# Altium schematic sheet GPS_LoraWAN.SchDoc: GPS and LoraWAN
size A4; DrawnBy: Carles Bataller Sebastiá; Revision: A; SheetNumber: 2; SheetTotal: 3
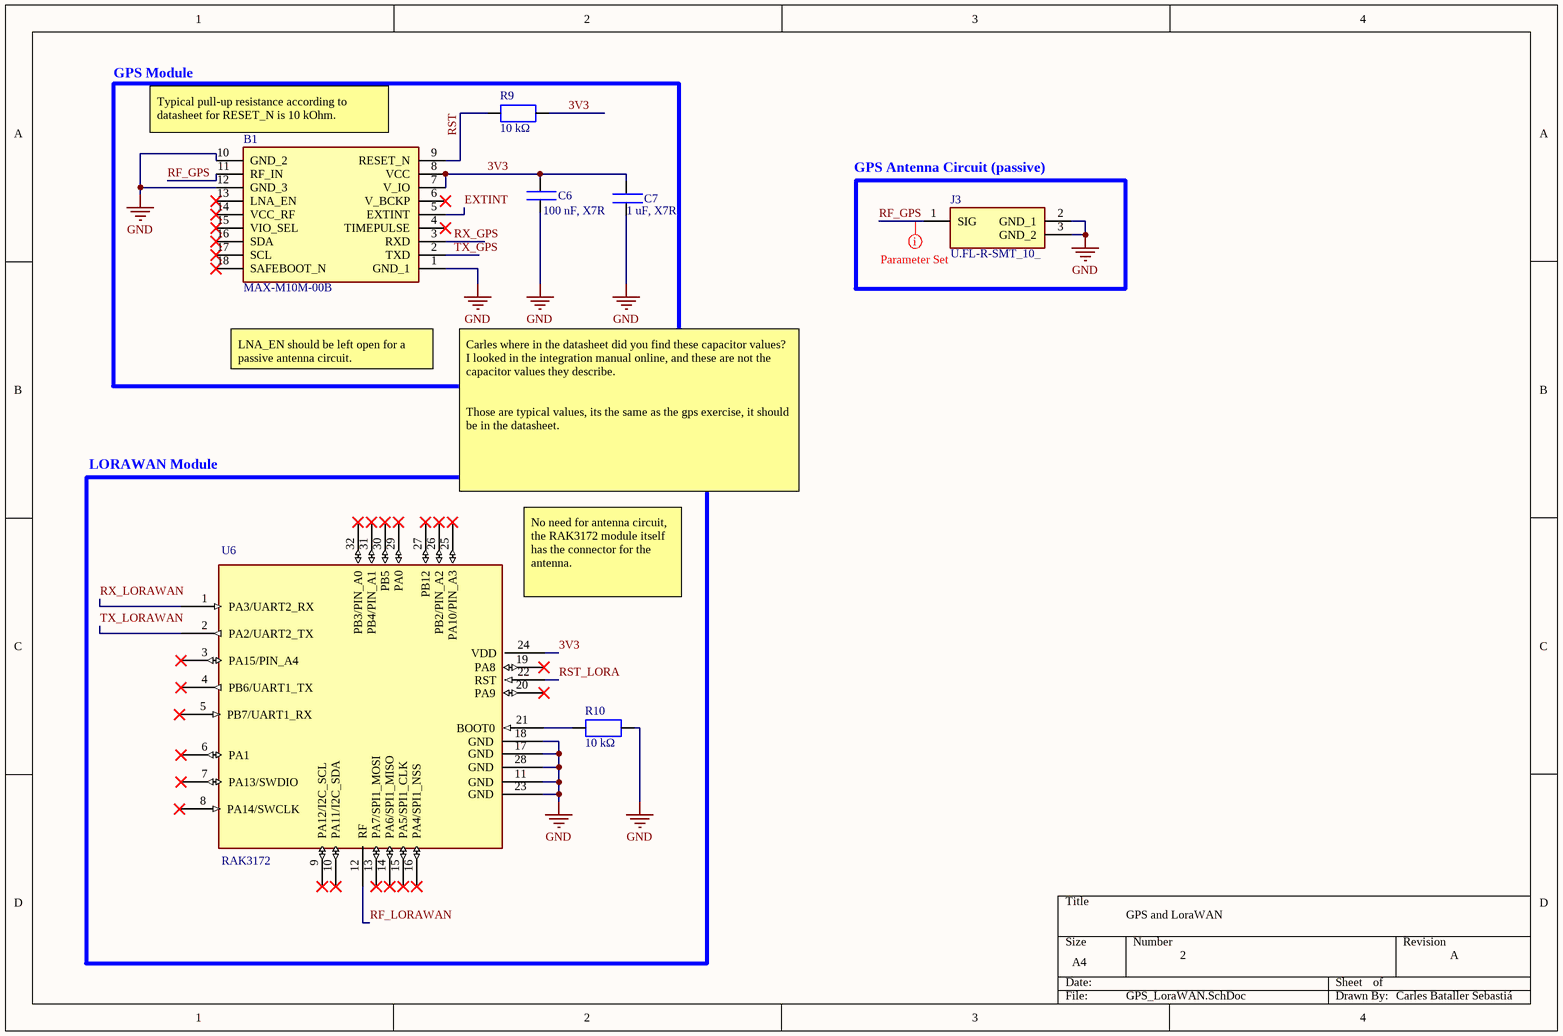
[diagram p0: GPS_LoraWAN.SchDoc]

## Parts
B1  MAX-M10M-00B  [MAXM10M00B]
C6  100 nF, X7R  [CAP_0402]
C7  1 uF, X7R  [CAP_0402]
J3  U.FL-R-SMT_10_  [UFLRSMT10]
R9  10 kΩ  [RES_0402]
R10  10 kΩ  [RES_0201]
U6  RAK3172  [XCVR_RAK3172]

## Blocks framed on the sheet
GPS Module: B1 C6 C7 R9
GPS Antenna Circuit (passive): J3
LORAWAN Module: R10 U6

## Nets
GND: B1.1(GND_1) B1.10(GND_2) B1.12(GND_3) C6.1 C7.1 J3.2(GND_1) J3.3(GND_2) R10.2 U6.11(GND) U6.17(GND) U6.18(GND) U6.23(GND) U6.28(GND)
3V3: B1.7(V_IO) B1.8(VCC) C6.2 C7.2 R9.2 U6.24(VDD)
EXTINT: B1.5(EXTINT)
RF_GPS: B1.11(RF_IN) J3.1(SIG)
RF_LORAWAN: U6.12(RF)
RST: B1.9(RESET_N) R9.1
RST_LORA: U6.22(RST)
RX_GPS: B1.3(RXD)
RX_LORAWAN: U6.1(PA3/UART2_RX)
TX_GPS: B1.2(TXD)
TX_LORAWAN: U6.2(PA2/UART2_TX)
NetR10_1: R10.1 U6.21(BOOT0)

Not connected (* = marked no-connect by the designer): B1 4(TIMEPULSE)* 6(V_BCKP)* 13(LNA_EN)* 14(VCC_RF)* 15(VIO_SEL)* 16(SDA)* 17(SCL)* 18(SAFEBOOT_N)*; U6 3(PA15/PIN_A4)* 4(PB6/UART1_TX)* 5(PB7/UART1_RX)* 6(PA1)* 7(PA13/SWDIO)* 8(PA14/SWCLK)* 9(PA12/I2C_SCL)* 10(PA11/I2C_SDA)* 13(PA7/SPI1_MOSI)* 14(PA6/SPI1_MISO)* 15(PA5/SPI1_CLK)* 16(PA4/SPI1_NSS)* 19(PA8)* 20(PA9)* 25(PA10/PIN_A3)* 26(PB2/PIN_A2)* 27(PB12)* 29(PA0)* 30(PB5)* 31(PB4/PIN_A1)* 32(PB3/PIN_A0)*

## Layout directives
net class RF: RF_GPS

## Notes on the sheet
- (near B1) Typical pull-up resistance according to datasheet for RESET_N is 10 kOhm.
- LNA_EN should be left open for a passive antenna circuit.
- Carles where in the datasheet did you find these capacitor values? I looked in the integration manual online, and these are not the capacitor values they describe.
  Those are typical values, its the same as the gps exercise, it should be in the datasheet.
- (near U6) No need for antenna circuit, the RAK3172 module itself has the connector for the antenna.

## Library data of the parts
B1 = MAX-M10M-00B: GPS Modules u-blox M10 GNSS LCC module, firmware in ROM, crystal oscillator; Geometry.Height: 2.7mm; Manufacturer 1: u-blox; Manufacturer Part Number 1: MAX-M10M-00B; Mouser Part Number: 377-MAX-M10M-00B; Mouser Price/Stock: https://www.mouser.co.uk/ProductDetail/u-blox/MAX-M10M-00B?qs=A6eO%252BMLsxmQGh8%2FJ1ZmexA%3D%3D; Arrow Part Number: MAX-M10M-00B; Arrow Price/Stock: https://www.arrow.com/en/products/max-m10m-00b/u-blox?utm_currency=USD&region=nac; Datasheet Link: https://content.u-blox.com/sites/default/files/documents/MAX-M10M_IntegrationManual_UBX-22038241.pdf; Supplier 1: Mouser; Supplier Part Number 1: 377-MAX-M10M-00B
C6 = CAP_0402: Multilayer Ceramic Capacitors MLCC - SMD/SMT CAP; Capacitance: 100 pF; Tolerance: 5%; Supplier 1: Mouser; Supplier Part Number 1: 581-0402X7R104KT2AT; LCSC Part Number: C106200
C7 = CAP_0402: Multilayer Ceramic Capacitors MLCC - SMD/SMT 6.3V 1uF X7R 0402 10% HI CV; Capacitance: 100 pF; Tolerance: 5%; Supplier 1: YAGEO; Supplier Part Number 1: CC0402JRNPO9BN101; LCSC Part Number: C106200
J3 = U.FL-R-SMT_10_: U.FL (UMCC) Connector Receptacle, Male Pin 50 Ohms Surface Mount Solder; Manufacturer 1: Hirose; Manufacturer Part Number 1: U.FL-R-SMT(10); Geometry.Height: 1.45mm; Supplier Part Number 1: 798-U.FL-R-SMT10; Mouser Price/Stock: https://www.mouser.co.uk/ProductDetail/Hirose-Connector/U.FL-R-SMT10?qs=Ux3WWAnHpjBT1CWD8UMEMQ%3D%3D; Arrow Part Number: U.FL-R-SMT(10); Arrow Price/Stock: https://www.arrow.com/en/products/u.fl-r-smt-10/hirose-electric?utm_currency=USD&region=nac; Datasheet Link: https://eu.mouser.com/datasheet/2/185/hiros05388_1-2269186.pdf; Supplier 1: Mouser
R9 = RES_0402: Resistor SMD 0402 Generic; Manufacturer: YAGEO; Manufacturer Part Number: RC0402FR07150KL; Tolerance: 1%; Resistance: 150 kOhm; LCSC Part Number: C93947
R10 = RES_0201: Thick Film Resistors - SMD 0201 10K0 1% Lead Free; Tolerance: 0.1%; Resistance: 200 Ohm; Supplier 1: Mouser; Supplier Part Number 1: 791-WR02X1002FAR; LCSC Part Number: C852221
U6 = RAK3172: Low-power, long-range transceiver module based on the STM32WLE5CC; Manufacturer 1: RAK; Supplier 1: RAK; Supplier Part Number 1: RAK3172; Manufacturer Part Number 1: RAK3172; Supplier Unit Price 1: 5,99; Supplier Subtotal 1: 5,99